# EasyEDA Pro project ReuseBlock_OPA847_2025-08-02.epro

# Schematic OPA847
Create Date: 2025-06-27; Page Name: P1; Project Name: AD8367可变增益放大器; Schematic Name: Schematic1; Update Date: 2025-06-30; Company: 深圳嘉立创科技集团股份有限公司; Drawed: LCEDA_02; Page Size: A4; Part Number: JLC-PCB-001; Reviewed: 嘉立创EDA; Version: V1.0
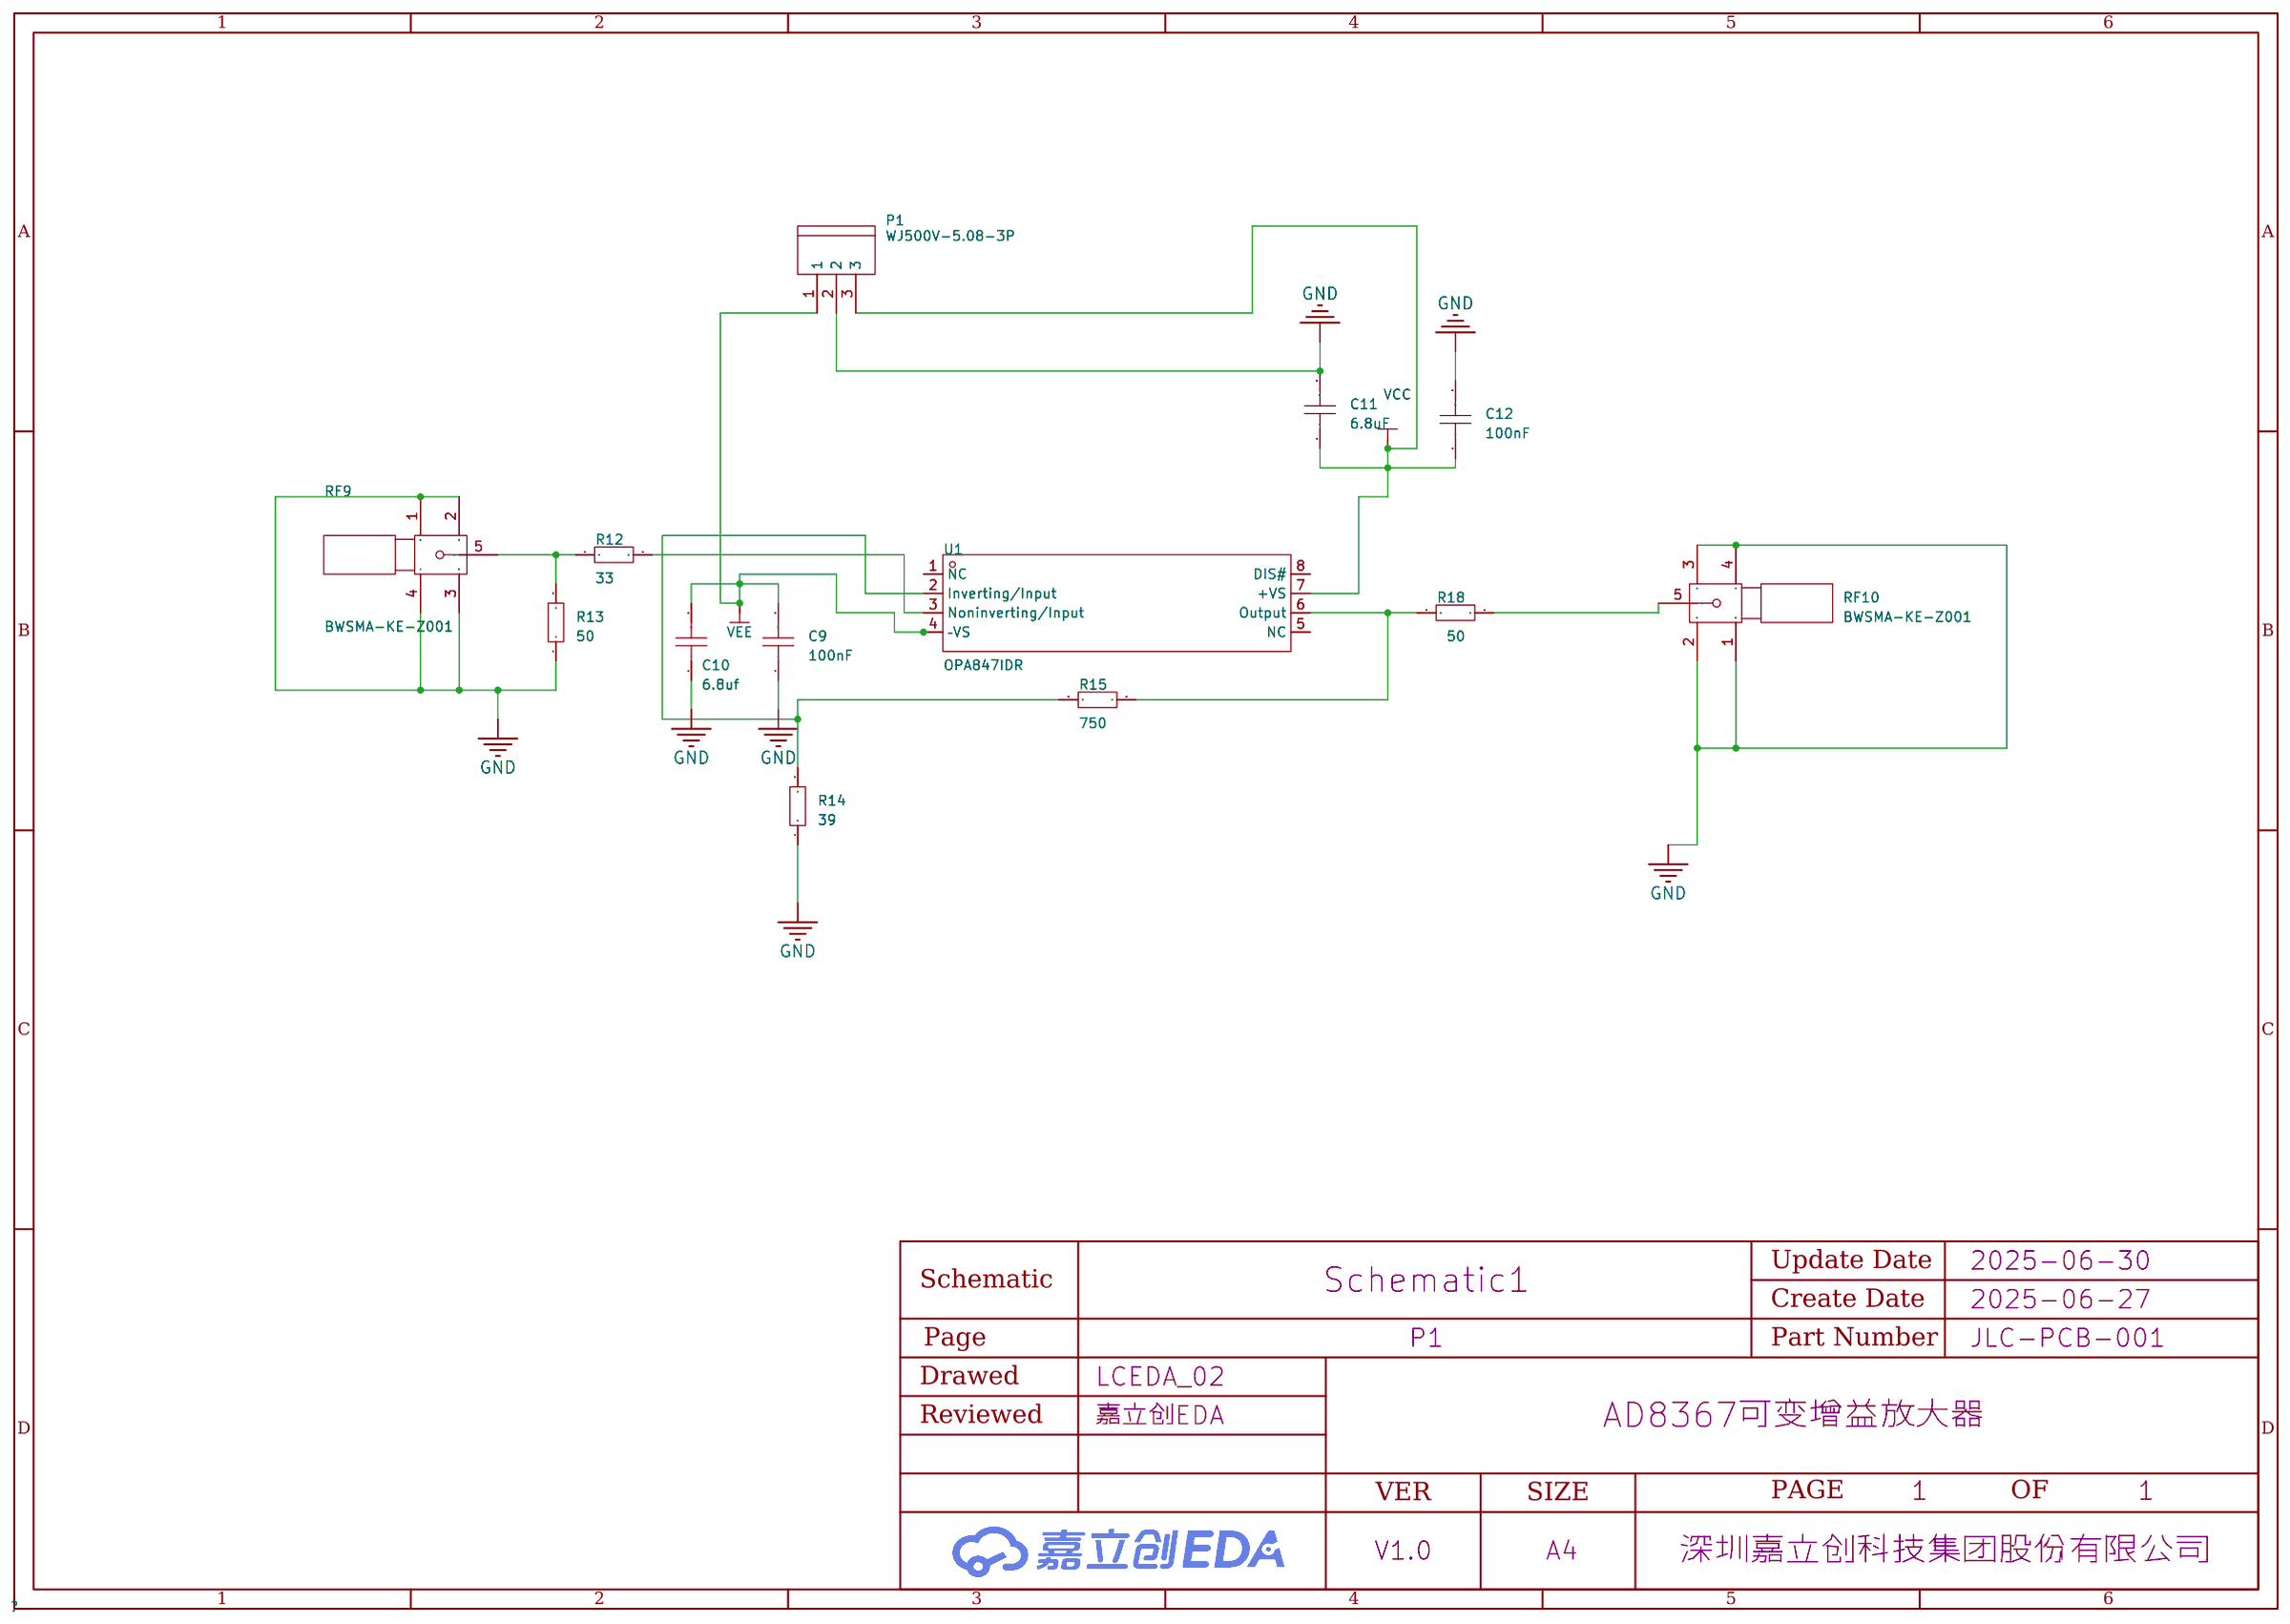
[diagram p0: schematic sheet]

## Parts
C9  100nF  [C0805]
C10  6.8uf  [C0805]
C11  6.8uF  [C0805]
C12  100nF  [C0805]
P1  WJ500V-5.08-3P  [CONN-TH_3P-P5.00_WJ500V-5.08-3P]
R12  33  [R0805]
R13  50  [R0805]
R14  39  [R0805]
R15  750  [R0805]
R18  50  [R0805]
RF9  BWSMA-KE-Z001  [SMA-TH_BWSMA-KE-Z001]
RF10  BWSMA-KE-Z001  [SMA-TH_BWSMA-KE-Z001]
U1  OPA847IDR  [SOIC-8_L4.9-W3.9-P1.27-LS6.0-TL]

## Library data of the parts
C9-C12 = CAP_0805: Supplier Footprint: 0805
P1 = WJ500V-5.08-3P: 结构:1x3P;间距:5.08mm;颜色:绿色;安装方式:直插;额定电流:18A;额定电压:250V;排数:1;线规 - AWG:14~30;线规 - 平方毫米:2.5;每排PIN数:3;工作温度范围:-40℃~+105℃;; LCSC Part Name: 5.08mm 1x3P 排数:1 每排P数:3 直插; Supplier Part: C72334; Manufacturer: KANGNEX(康奈克斯电气); Supplier Footprint: 插件,P=5.08mm; JLCPCB Part Class: 扩展库; Datasheet: https://atta.szlcsc.com/upload/public/pdf/source/20191225/C72334_8A5EF831D67650233B6B1E3F2BC06274.pdf; Supplier: LCSC; Structure: 1x3P; Pitch: 5.08mm; Color: 绿色; Mounting Style: 直插; Current Rating (Max): 18A; Voltage Rating (Max): 250V; Number of Pins: 3P; Number of Rows: 1; Wire Gauge - AWG: 14~30; Wire Gauge - mm2: 2.5; Number of PINs Per Row: 3; Operating Temperature Range: -40℃~+105℃
R12-R15 R18 = Res_0805: Supplier Footprint: 0805
RF9 RF10 = BWSMA-KE-Z001_C496549: 连接器类型:板端;接口类型:内孔;端口数量:1;接口直径:-;接口长度/高度:-;频率-最大值:-;射频系列:SMA;阻抗:50Ω;样式:正脚;触头材质:-;触头镀层:-;工作温度范围:-65℃~+165℃;焊接温度(最大值):-;; LCSC Part Name: 内孔 SMA 正脚; Supplier Part: C496549; Manufacturer: BAT WIRELESS(蝙蝠无线); Supplier Footprint: 插件; JLCPCB Part Class: 扩展库; Datasheet: https://atta.szlcsc.com/upload/public/pdf/source/20221228/40BF41E56A06003A0210E1785CA66EA6.pdf; Supplier: LCSC; Connector Type: 板端; Interface Type: 内孔; Number of Ports: 1; RF Series: SMA; Impedance: 50Ω; Style: 正脚; Operating Temperature Range: -65℃~+165℃
U1 = OPA847IDR: 放大器数:单路;增益带宽积(GBP):3.9GHz;压摆率(SR):950V/us;输入偏置电流(Ib):19uA;; Supplier Part: C2870028; Manufacturer: TI(德州仪器); Supplier Footprint: SOIC-8; JLCPCB Part Class: 扩展库; Datasheet: https://www.ti.com/cn/lit/gpn/opa847; Supplier: LCSC; Number of Circuits: 单路; Gain Bandwidth Product(GBP): 3.9GHz; Slew Rate(SR): 950V/us; Current - Input Bias(Ib): 19uA; Output Current: 100mA; Operating Temperature: -40℃~+85℃

## Nets
GND: C9.1 C10.1 C11.2 C12.2 P1.2 R13.1 R14.1 RF9.1 RF9.2 RF9.3 RF9.4 RF10.1 RF10.2 RF10.3 RF10.4
VCC: C11.1 C12.1 P1.3 U1.7(+VS)
VEE: C9.2 C10.2 P1.1 U1.4(–VS)
$1N3184: R12.1 R13.2 RF9.5
$1N4717: R12.2 U1.3(Noninverting/Input)
$1N4726: R14.2 R15.1 U1.2(Inverting/Input)
$1N4738: R15.2 R18.1 U1.6(Output)
$1N4831: R18.2 RF10.5

Not connected (* = marked no-connect by the designer): U1 1(NC) 5(NC) 8(DIS#)

# Board OPA847
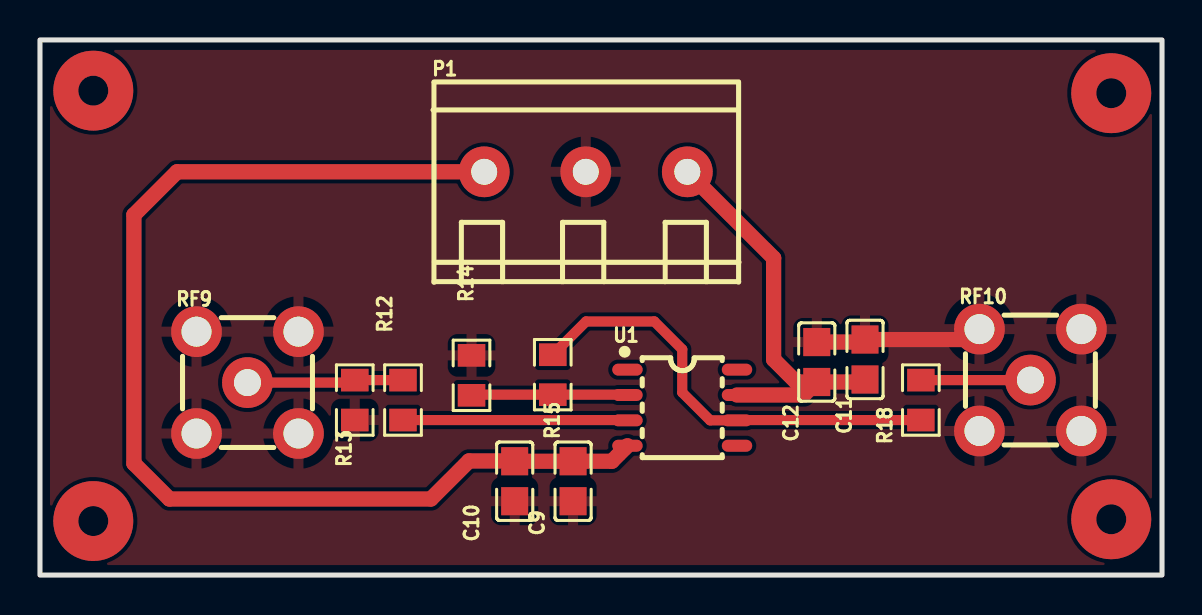
[diagram p1: board, top side]
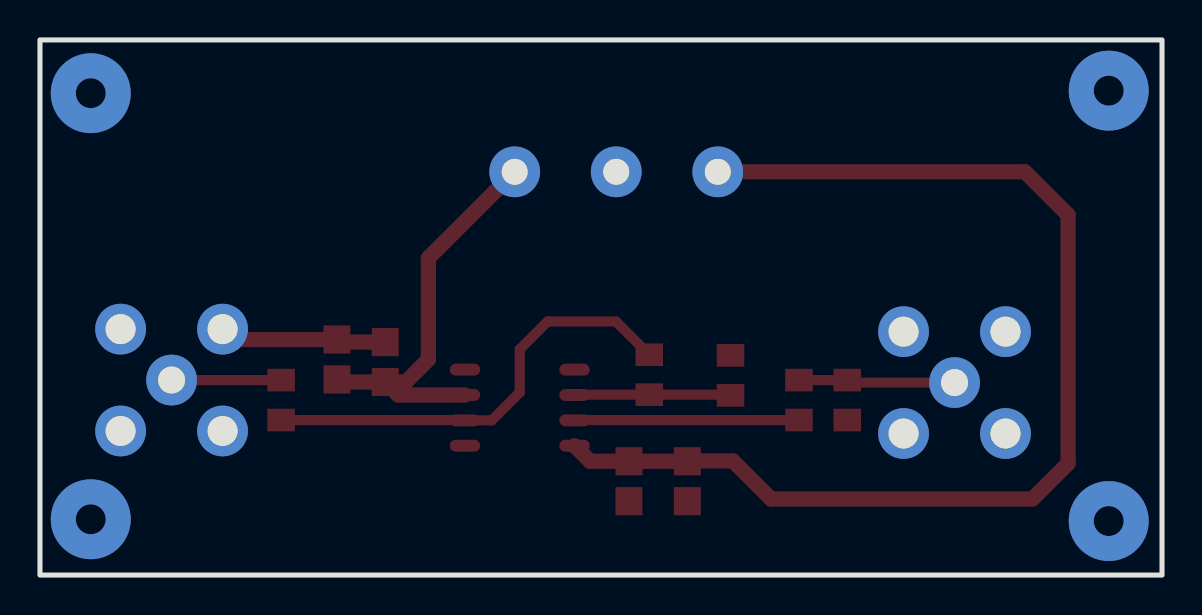
[diagram p2: board, bottom side, seen from below]

Outline 56.13 x 26.8 mm; copper layers: Top Layer, Bottom Layer. Coordinates in mm from the lower left corner of the outline.
Outline path: rectangle 0,26.8 56.13,0
Stack: Top Layer 0.035mm / Dielectric1 1.51mm FR4 er 4.5 / Bottom Layer 0.035mm

## Design rules (mm)
template: 自定义配置
spacing copperThickness1oz (default): track to track 0.102, other pairs 0.152 to 0.3
spacing copperThickness2oz: track to track 0.203, other pairs 0.152 to 0.3
track width copperThickness1oz (default): min 0.127, default 0.254, max 2.54
track width copperThickness2oz: min 0.203, default 0.254, max 2.54
differential pair differentialPair (default): width min 0.127, default 0.254, max 2.54; gap min 0.152, default 0.152
via viaSize (default): diameter min 0.5, default 0.61, max 10; hole min 0.3, default 0.305, max 6.299

## Placement (name value [footprint] x y rotation side)
C9  100nF  [C0805]  26.67 4.7 90 top
C10  6.8uf  [C0805]  23.75 4.7 90 top
C11  6.8uF  [C0805]  41.28 10.8 90 top
C12  100nF  [C0805]  38.86 10.67 90 top
P1  WJ500V-5.08-3P  [conn-th_3p-p5.00_wj500v-5.08-3p]  27.31 20.19 0 top
R12  33  [R0805]  18.16 8.76 270 top
R13  50  [R0805]  15.75 8.76 90 top
R14  39  [R0805]  21.59 10 270 top
R15  750  [R0805]  25.65 10.03 90 top
R18  50  [R0805]  44.07 8.76 90 top
RF9  BWSMA-KE-Z001  [sma-th_bwsma-ke-z001]  10.38 9.64 0 top
RF10  BWSMA-KE-Z001  [sma-th_bwsma-ke-z001]  49.55 9.77 0 top
U1  OPA847IDR  [SOIC-8_L4.9-W3.9-P1.27-LS6.0-TL]  32.13 8.38 0 top

## Footprints (pads in the part's own frame, mm; a bottom-side part is the same pattern mirrored in y, then rotated)
C0805
  rect 1.41x1.35 smd: 1(-1,0) 2(1,0)
conn-th_3p-p5.00_wj500v-5.08-3p
  round 2.54 hole 1.3: 1(-5.08,0) 2(0,0) 3(5.08,0)
R0805
  rect 1.133x1.377 smd: 1(-1,0) 2(1,0)
sma-th_bwsma-ke-z001
  round 2.54 hole 1.5: 1(-2.55,-2.55) 2(-2.55,2.55) 3(2.55,2.55) 4(2.55,-2.55)
  round 2.54 hole 1.35: 5(0,0)
SOIC-8_L4.9-W3.9-P1.27-LS6.0-TL
  oval 1.52x0.6 smd: 1(-2.74,1.905) 2(-2.74,0.635) 3(-2.74,-0.635) 4(-2.74,-1.905) 5(2.74,-1.905) 6(2.74,-0.635) 7(2.74,0.635) 8(2.74,1.905)

## Nets
As in the schematic.

Pads without a net: U1 1 5 8

## Via types
v1: diameter 4, hole 1.5, Top Layer to Bottom Layer, 4 vias

## Routing (per net, layer and track width the routed paths; a pad name or vN(x,y) marks a point on that pad's centre or on a via; arc(x,y) is an arc through that point)
GND: length 8.4
  Top Layer w0.762: RF10.2 46.48,11.8 C11.2 41.15,11.67 C12.2
VCC: length 20.5
  Top Layer w0.762: C12.1 38.21,9.02 34.87,9.02 ; C12.1 37.83,9.67 36.7,10.8 36.7,15.88 P1.3 ; C12.1 41.15,9.67 C11.1
VEE: length 57.4
  Top Layer w0.762: U1.4 28.61,5.7 C9.2 C10.2 23.73,5.72 21.46,5.72 19.56,3.81 6.48,3.81 4.7,5.59 4.7,18.03 6.86,20.19 P1.1
(no net):
  vias: v1(2.67,24.26) v1(2.67,2.7) v1(53.59,24.13) v1(53.59,2.79)
$1N3184: length 7.8
  Top Layer w0.508: R12.1 R13.2 15.62,9.64 RF9.5
$1N4717: length 11.2
  Top Layer w0.508: U1.3 29.38,7.76 R12.2
$1N4726: length 7.8
  Top Layer w0.508: U1.2 29.38,9.03 R15.1 21.62,9.03 R14.2
$1N4738: length 22.4
  Top Layer w0.508: R15.2 27.32,12.7 30.73,12.7 32.13,11.3 32.13,9.14 33.53,7.75 34.87,7.75 34.89,7.76 R18.1
$1N4831: length 5.5
  Top Layer w0.508: R18.2 49.55,9.76 RF10.5

## Copper pours and planes (outline as drawn; the poured copper is in the pictures)
GND on Top Layer: 0,26.8 56.13,26.8 56.13,0 0,0
